# EAGLE design Ideal Diode test (EAGLE 7.4.0)
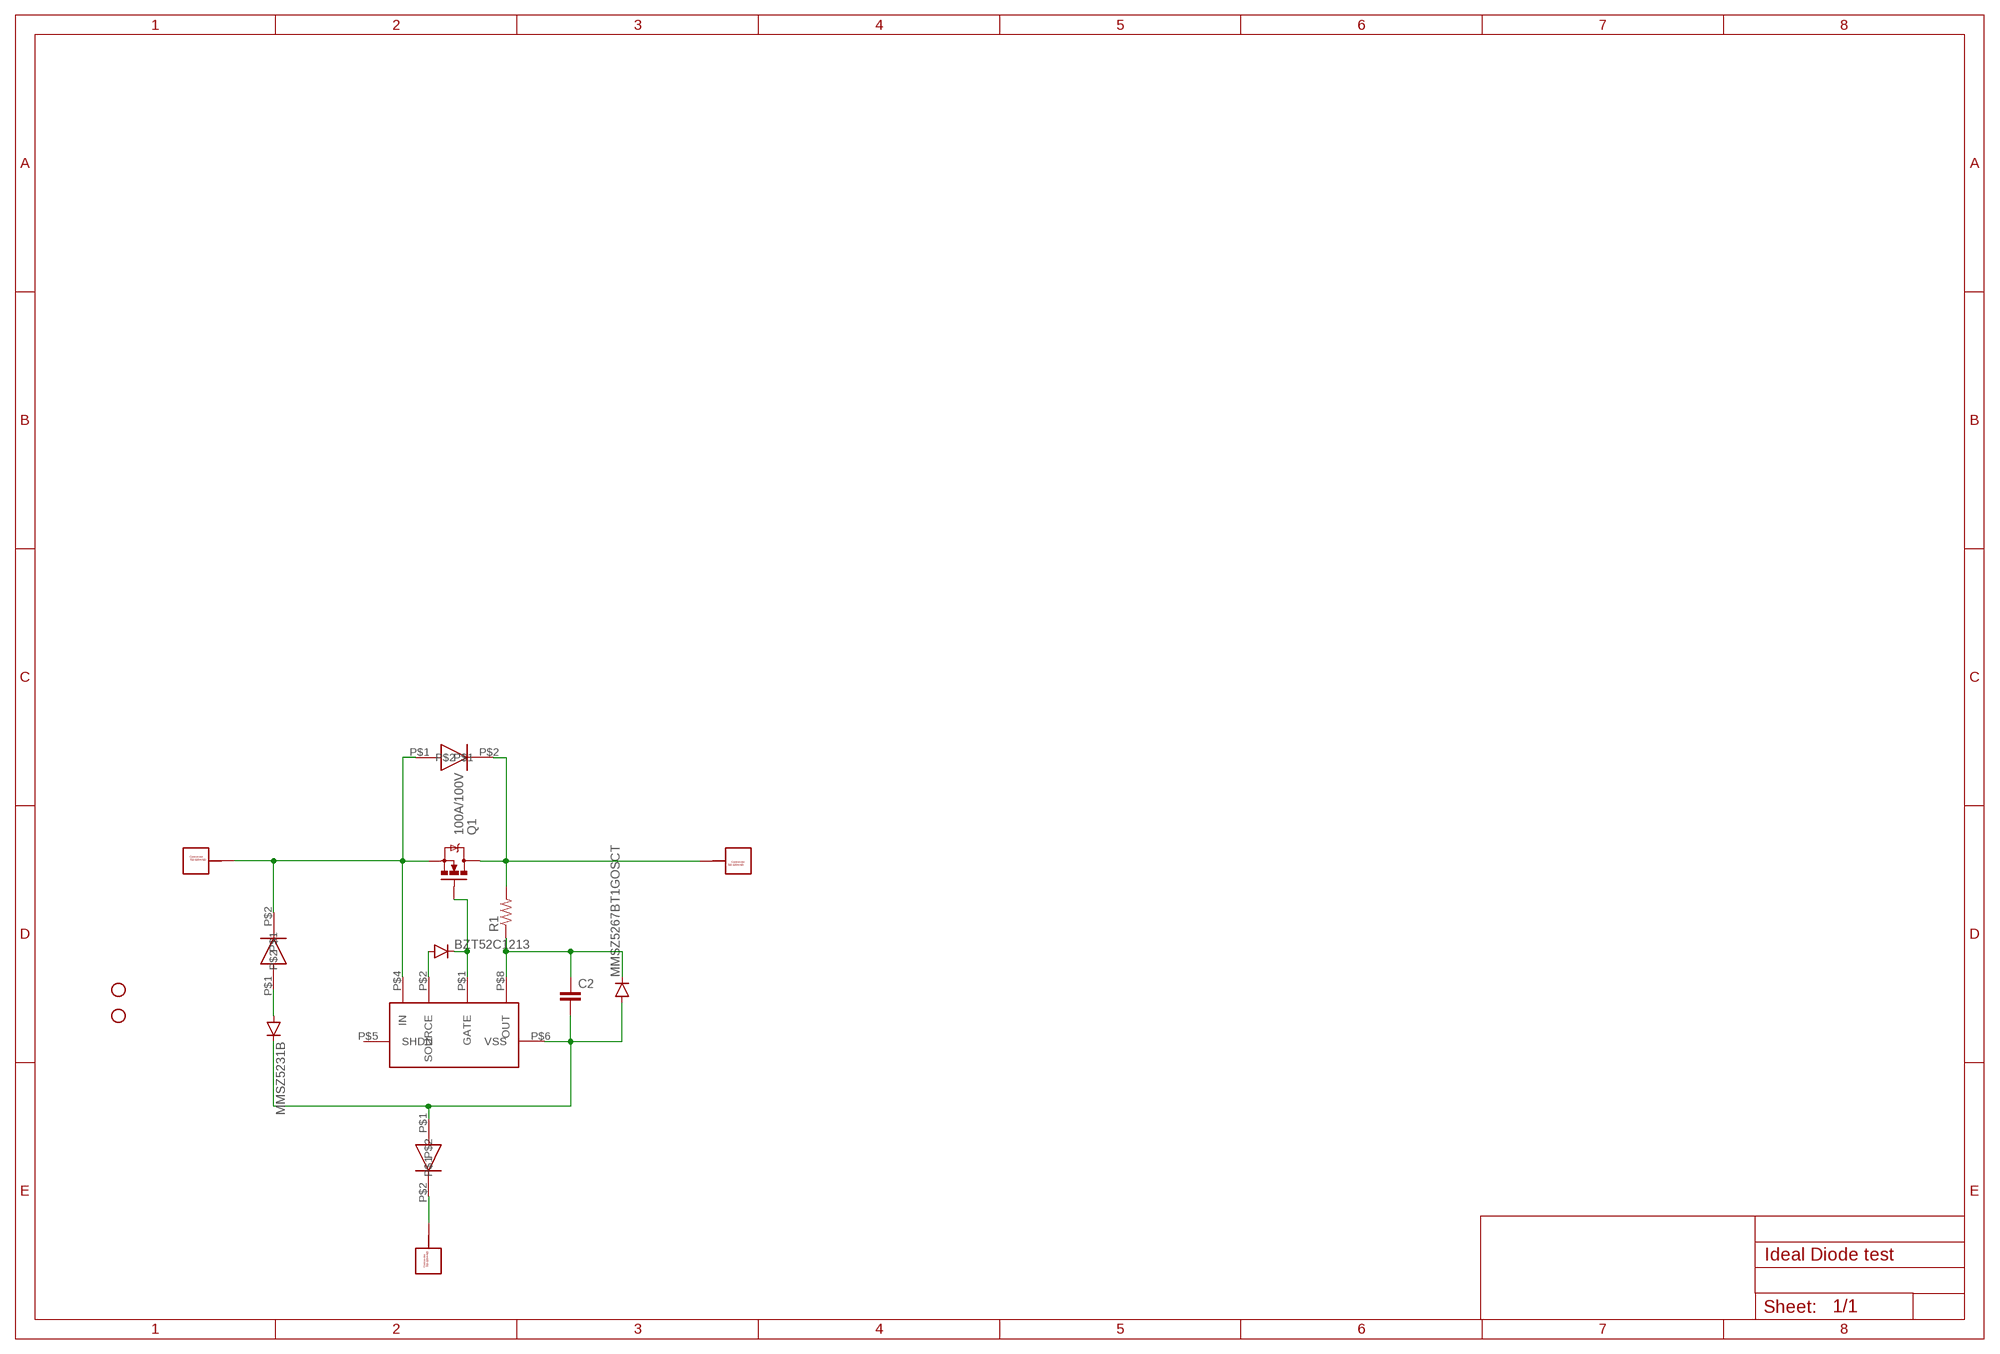
[diagram p0: schematic, sheet 1]

## Parts
BZT52C1213  DIODESOD123  [SOD-123]
C2  CAP0603-CAP  [0603-CAP]
MMSZ5231B  DIODESOD123  [SOD-123]
MMSZ5267BT1GOSCT  DIODESOD123  [SOD-123]
Q1  100A/100V  MOSFET-NCHANNELPSMN7R0  [TO-263/D2PAK]
R1  RESISTOR0603-RES  [0603-RES]
S1B  DIODE  [SMA]
SMAJ70A  DIODE  [SMA]
SMAJ150A  DIODE  [SMA]
STANDOFF1  STAND-OFF  [STAND-OFF]
STANDOFF2  STAND-OFF  [STAND-OFF]
U$1  LTC359  [LTC4359]
U$2  732-3204-ND_CONNECTOR  [732-3204-ND]
U$3  732-3204-ND_CONNECTOR  [732-3204-ND]
U$4  732-3204-ND_CONNECTOR  [732-3204-ND]

## Nets
GND: S1B.P$2 U$4.P$1 U$4.P$2 U$4.P$3 U$4.P$4 U$4.P$5 U$4.P$6 U$4.P$7 U$4.P$8 U$4.P$9 U$4.P$10
N$1: Q1.3(S) SMAJ70A.P$2 SMAJ150A.P$1 U$1.P$4(IN) U$3.P$1 U$3.P$2 U$3.P$3 U$3.P$4 U$3.P$5 U$3.P$6 U$3.P$7 U$3.P$8 U$3.P$9 U$3.P$10
N$2: Q1.2(D) R1.2 SMAJ150A.P$2 U$2.P$1 U$2.P$2 U$2.P$3 U$2.P$4 U$2.P$5 U$2.P$6 U$2.P$7 U$2.P$8 U$2.P$9 U$2.P$10
N$3: C2.1 MMSZ5267BT1GOSCT.C R1.1 U$1.P$8(OUT)
N$4: BZT52C1213.A U$1.P$2(SOURCE)
N$5: BZT52C1213.C Q1.1(G) U$1.P$1(GATE)
N$6: C2.2 MMSZ5231B.C MMSZ5267BT1GOSCT.A S1B.P$1 U$1.P$6(VSS)
N$7: MMSZ5231B.A SMAJ70A.P$1
Unconnected: U$1.P$5(SHDN)

## Library data of the parts
BZT52C1213 MMSZ5231B MMSZ5267BT1GOSCT = SparkFun-DiscreteSemi:DIODE: Diode These are standard reverse protection diodes and small signal diodes. SMA package can handle up to about 1A. SOD-323 can handle about 200mA. What the SOD-323 package when ordering, there are some mfgs out there that are 5-pin packages.
C2 = SparkFun-Passives:CAP: Capacitor Standard 0603 ceramic capacitor, and 0.1" leaded capacitor.
Q1 = SparkFun-DiscreteSemi:MOSFET-NCHANNEL: Common NMOSFET Parts MFG P/N Store ID Prod ID FDD8780 TRANS-09984 SI7820DN TRANS-11055 FDS6630A IC-08089 2N7002PW TRANS-11151 FQP30N06L COM-10213 TRANS-10060 BSS123LT1G TRANS-08345 BSS138 TRANS-00830 BS170 2N7000; PROD_ID: TRANS-12437
R1 = SparkFun-Passives:RESISTOR: Resistor Basic schematic elements and footprints for 0603, 1206, and PTH resistors.
S1B SMAJ70A SMAJ150A = ianslbr:DIODE
STANDOFF1 STANDOFF2 = SparkFun-Electromechanical:STAND-OFF: #4 Stand Off This is the mechanical footprint for a #4 phillips button head screw. Use the keepout ring to avoid running the screw head into surrounding components. SKU : PRT-00447
U$1 = ianslbr:LTC359
U$2-U$4 = Connector 732-3204:732-3204-ND_CONNECTOR

## Board
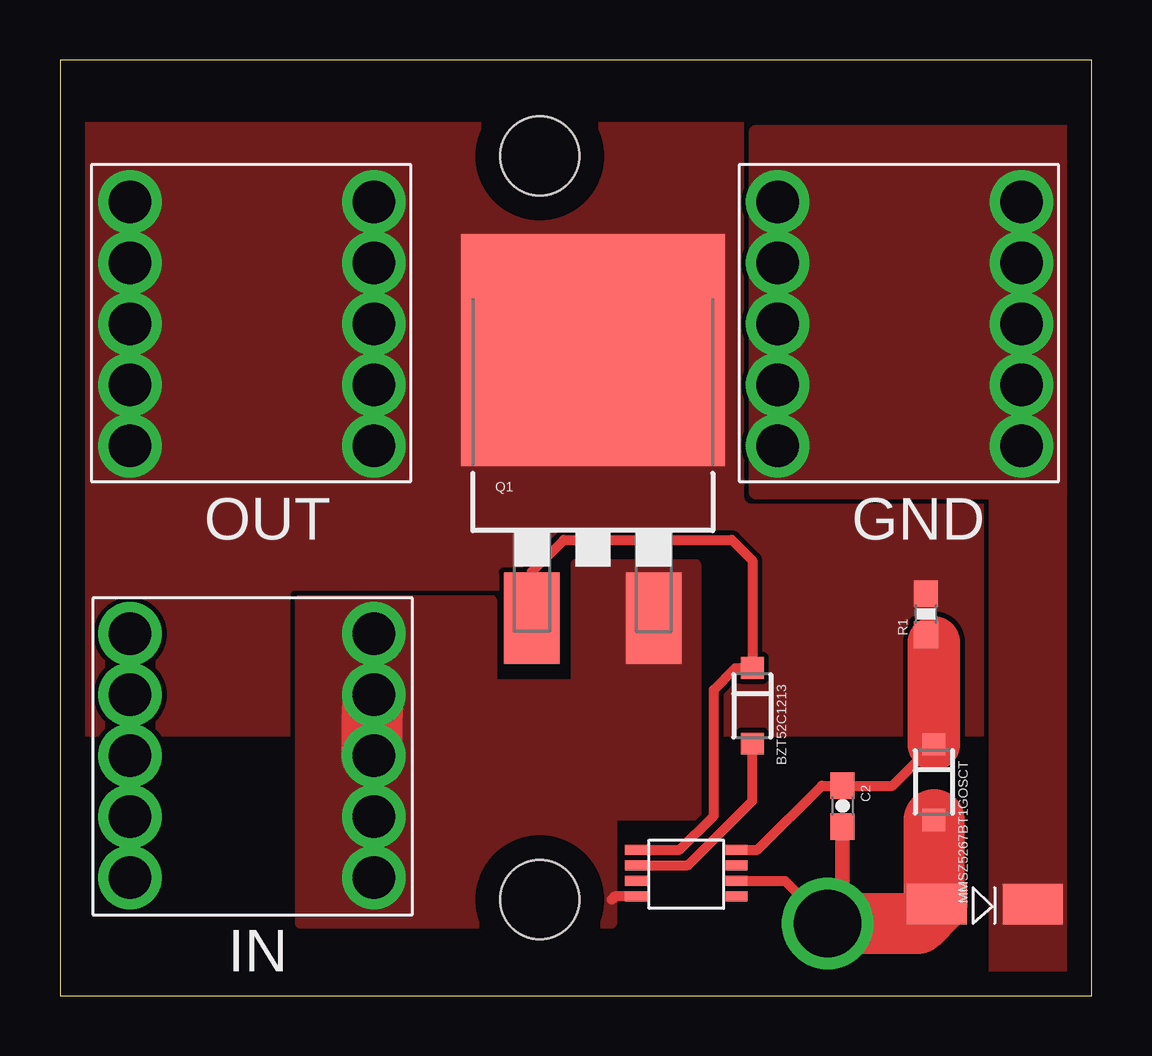
[diagram p1: board, top side]
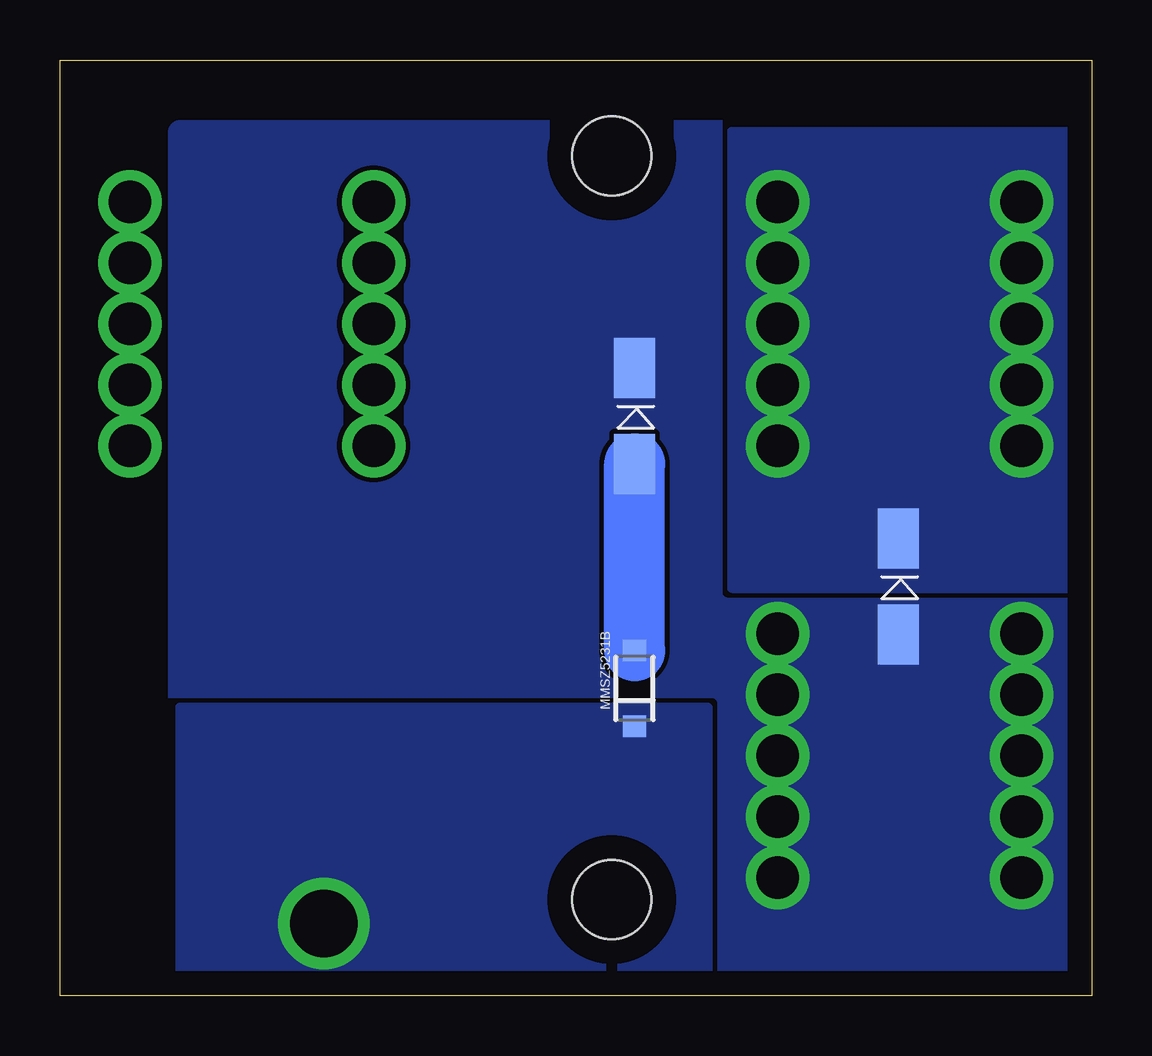
[diagram p2: board, bottom side, seen from below]

Size 43 x 39 mm. Coordinates in mm from the lower left corner, seen from the top.
Outline: 0,0 43,0 43,39 0,39 0,0
Copper layers (1*16): Top 0.035mm / dielectric 1.5mm / Bottom 0.035mm
Design rules "default": minimum track width 10mil, minimum drill 24mil, track to track 8mil, track to pad 8mil, pad to pad 8mil, via to via 8mil, smd to smd 8mil, copper to edge 40mil, drill to drill 8mil, minimum pad ring 10mil, minimum via ring 8mil, stop-mask expansion 4mil, vias tented up to drill 0mil, thermal gap 10mil

### Footprints (pad centres in the part's own frame; a part is rotated, then mirrored left to right if it is on the bottom)
SOD-123 = smd 0.9 x 0.95: A 1.575,0; C -1.575,0
0603-CAP = smd 1.1 x 1: 1 -0.85,0; 2 0.85,0
TO-263/D2PAK = smd 2.32 x 3.81: 1 -2.54,-7.045; 3 2.54,-7.045 | smd 11 x 9.65: 2 0,4.125
0603-RES = smd 1.1 x 1: 1 -0.85,0; 2 0.85,0
SMA = smd 2.5 x 1.7: P$1 0,0; P$2 4,0
STAND-OFF = hole 3.302: 0,0
LTC4359 = smd 0.42 x 0.9: P$1 -1,-2.2; P$2 -0.35,-2.2; P$3 0.3,-2.2; P$4 0.95,-2.2; P$5 0.95,2; P$6 0.3,2; P$7 -0.35,2; P$8 -1,2
732-3204-ND = drill 1.76: P$1 -5.08,5.08; P$2 -2.54,5.08; P$3 0,5.08; P$4 2.54,5.08; P$5 5.08,5.08; P$6 5.08,-5.08; P$7 2.54,-5.08; P$8 0,-5.08; P$9 -2.54,-5.08; P$10 -5.08,-5.08

### Placement (x,y rotation side)
BZT52C1213  28.86,12.08 270 top
C2  32.62,7.9 270 top
MMSZ5231B  19.05,12.81 90 bottom
MMSZ5267BT1GOSCT  36.43,8.9 270 top
Q1  22.21,22.78 0 top
R1  36.1,15.9 90 top
S1B  36.56,3.81 0 top
SMAJ70A  19.05,22.16 90 bottom
SMAJ150A  8.05,15.05 90 bottom
STANDOFF1  20,35 0 top
STANDOFF2  20,4 0 top
U$1  26.21,5.08 270 top
U$2  8,28 90 top
U$3  8,10 270 top
U$4  35,28 90 top

### Tracks (layer width: path | path; a pad name or v marks a point on that pad's centre or on a via)
GND
  pour Top (no thermals): 43,36 29,36 29,21 39,21 39,0 43,0
N$1
  Top 0.406: U$3.P$5 13.29,4.13 | U$1.P$4 23.13,4.13 23,4
  Top 2.54: 13,10 13,11.46 U$3.P$2
  pour Bottom (rank 2, no thermals): 0,36 38,36 38,0 0,0
  pour Top (no thermals): 21.5,18 26.5,18 26.5,7.5 23,7.5 23,3 10,3 10,16.5 18,16.5 18,13 21.5,13
N$2
  pour Top (rank 2, no thermals): 38.42,36.21 38.42,11 0,11 0,36.21
  pour Bottom (no thermals): 1,36 15,36 15,17 1,17
N$3
  Top 0.406: MMSZ5267BT1GOSCT.C 34.7,8.75 C2.1 31.75,8.75 29.08,6.08 U$1.P$8
  Top 0.61: R1.1 36.43,14.72
  Top 2.184: 36.43,14.72 MMSZ5267BT1GOSCT.C
N$4
  Top 0.406: U$1.P$2 26.18,5.43 28.86,8.11 BZT52C1213.A
N$5
  Top 0.406: Q1.1 19.67,17.67 21,19 28,19 28.86,18.14 BZT52C1213.C 28.16,13.65 27.25,12.75 27.25,7.5 25.83,6.08 U$1.P$1
N$6  (via drill 2.8)
  Top 0.406: MMSZ5267BT1GOSCT.A 36.56,7.2 | U$1.P$6 30.22,4.78 v32,3 | C2.2 32.9,7.33
  Top 0.61: C2.2 32.62,3.62 v32,3
  Top 2.54: v32,3 35.75,3 S1B.P$1 36.43,3.94 MMSZ5267BT1GOSCT.A
  pour Bottom (no thermals): 16,12 38,12 38,1 16,1
N$7
  Bottom 2.54: MMSZ5231B.A SMAJ70A.P$1

### Text on the board
tPlace: OUT | GND | IN